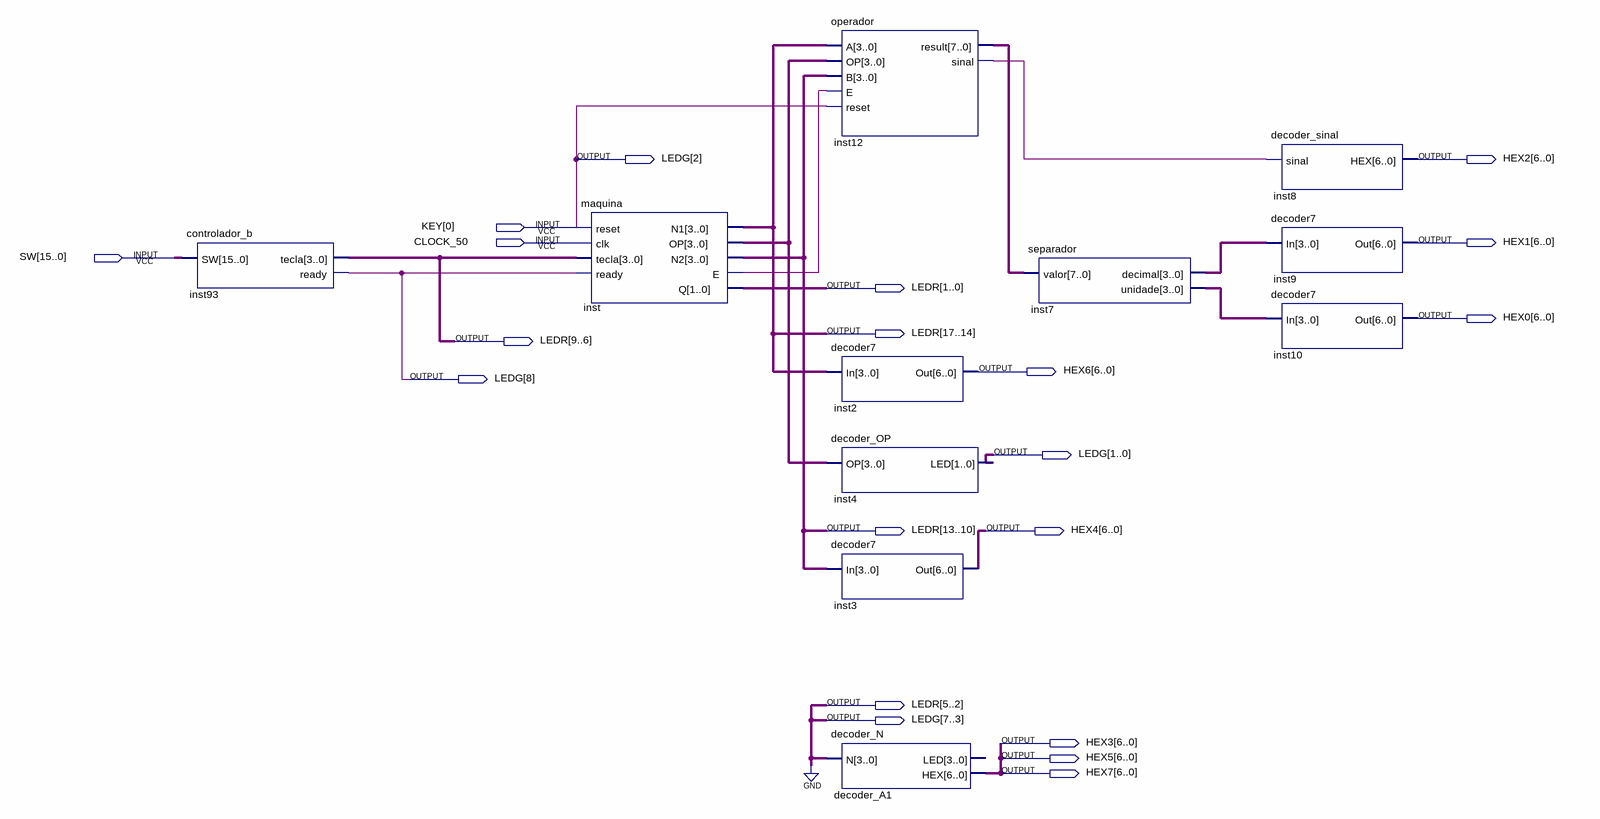
[diagram p0: schematic sheet]
// Quartus schematic teste2.bdf as structural Verilog: 11 symbols, 20 pins
module teste2 (
  input  [0:0] KEY,
  input  CLOCK_50,
  input  [15:0] SW,
  output [8:0] LEDG,
  output [6:0] HEX2,
  output [6:0] HEX1,
  output [17:0] LEDR,
  output [6:0] HEX0,
  output [6:0] HEX6,
  output [6:0] HEX4,
  output [6:0] HEX3,
  output [6:0] HEX5,
  output [6:0] HEX7
);

  wire inst12_sinal, inst_e;
  wire [3:0] inst7_decimal, inst7_unidade, inst_op;
  wire [7:0] inst12_result;

  controlador_b inst93 (.SW(SW), .tecla(LEDR[9:6]), .ready(LEDG[8]));
  maquina inst (
    .reset(KEY[0]), .clk(CLOCK_50), .tecla(LEDR[9:6]), .ready(LEDG[8]), .N1(LEDR[17:14]), .OP(inst_op),
    .N2(LEDR[13:10]), .E(inst_e), .Q(LEDR[1:0]));
  operador inst12 (
    .A(LEDR[17:14]), .OP(inst_op), .B(LEDR[13:10]), .E(inst_e), .reset(KEY[0]), .result(inst12_result),
    .sinal(inst12_sinal));
  decoder7 inst2 (.In(LEDR[17:14]), .Out(HEX6));
  decoder_OP inst4 (.OP(inst_op), .LED(LEDG[1:0]));
  decoder7 inst3 (.In(LEDR[13:10]), .Out(HEX4));
  decoder_N decoder_A1 (.N({5{1'b0}}), .HEX(HEX3));  // open: LED
  separador inst7 (.valor(inst12_result), .decimal(inst7_decimal), .unidade(inst7_unidade));
  decoder_sinal inst8 (.sinal(inst12_sinal), .HEX(HEX2));
  decoder7 inst9 (.In(inst7_decimal), .Out(HEX1));
  decoder7 inst10 (.In(inst7_unidade), .Out(HEX0));

  assign HEX5 = HEX3;
  assign HEX7 = HEX3;
  assign LEDG[7:2] = {{5{1'b0}}, KEY[0]};
endmodule
